# EAGLE schematic MODI (EAGLE 6.3)
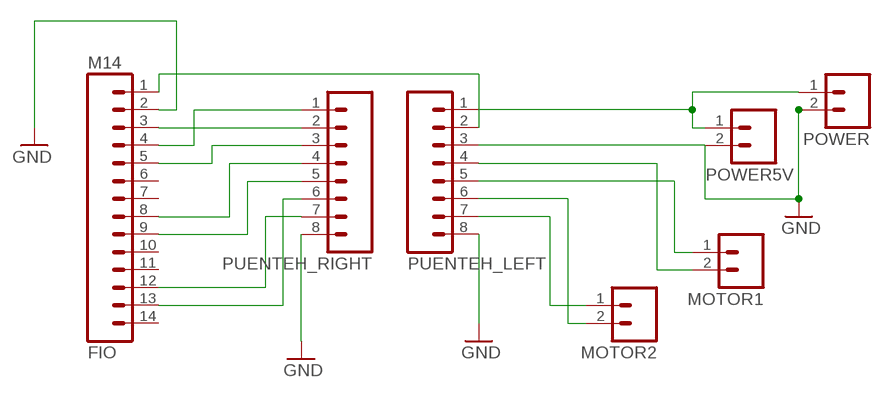
[diagram p0: schematic, sheet 1]

## Parts
FIO  M14  [1X14]
MOTOR1  M023.5MM  [SCREWTERMINAL-3.5MM-2]
MOTOR2  M023.5MM  [SCREWTERMINAL-3.5MM-2]
POWER  M023.5MM  [SCREWTERMINAL-3.5MM-2]
POWER5V  M02PTH  [1X02]
PUENTEH_LEFT  M08LONGPADS  [1X08_LONGPADS]
PUENTEH_RIGHT  M08LONGPADS  [1X08_LONGPADS]

## Nets
5V: POWER5V.1 POWER.1 PUENTEH_LEFT.1
GND: FIO.2 POWER5V.2 POWER.2 PUENTEH_LEFT.3 PUENTEH_LEFT.8 PUENTEH_RIGHT.8
N$1: FIO.3 PUENTEH_RIGHT.2
N$2: FIO.4 PUENTEH_RIGHT.1
N$3: FIO.5 PUENTEH_RIGHT.3
N$4: FIO.12 PUENTEH_RIGHT.7
N$5: FIO.8 PUENTEH_RIGHT.4
N$6: FIO.9 PUENTEH_RIGHT.5
N$7: FIO.13 PUENTEH_RIGHT.6
N$8: MOTOR1.2 PUENTEH_LEFT.4
N$9: MOTOR1.1 PUENTEH_LEFT.5
N$10: MOTOR2.2 PUENTEH_LEFT.6
N$11: MOTOR2.1 PUENTEH_LEFT.7
N$14: FIO.1 PUENTEH_LEFT.2
Unconnected: FIO.6 FIO.7 FIO.10 FIO.11 FIO.14

## Library data of the parts
FIO = SparkFun-Connectors:M14: Header 14 Standard 14-pin 0.1" header. Use with straight break away headers (SKU : PRT-00116), right angle break away headers (PRT-00553), swiss pins (PRT-00743), machine pins (PRT-00117), and female headers (PRT-00115).
MOTOR1 MOTOR2 POWER POWER5V = SparkFun-Connectors:M02: Header 2 Standard 2-pin 0.1" header. Use with straight break away headers (SKU : PRT-00116), right angle break away headers (PRT-00553), swiss pins (PRT-00743), machine pins (PRT-00117), and female headers (PRT-00115). Molex polarized connector foot print use with SKU : PRT-08233 with associated crimp pins and housings.
PUENTEH_LEFT PUENTEH_RIGHT = SparkFun-Connectors:M08: Header 8 Standard 8-pin 0.1" header. Use with straight break away headers (SKU : PRT-00116), right angle break away headers (PRT-00553), swiss pins (PRT-00743), machine pins (PRT-00117), and female headers (PRT-00115).